# EAGLE design MRCS-cpNode (EAGLE 7.7.0)
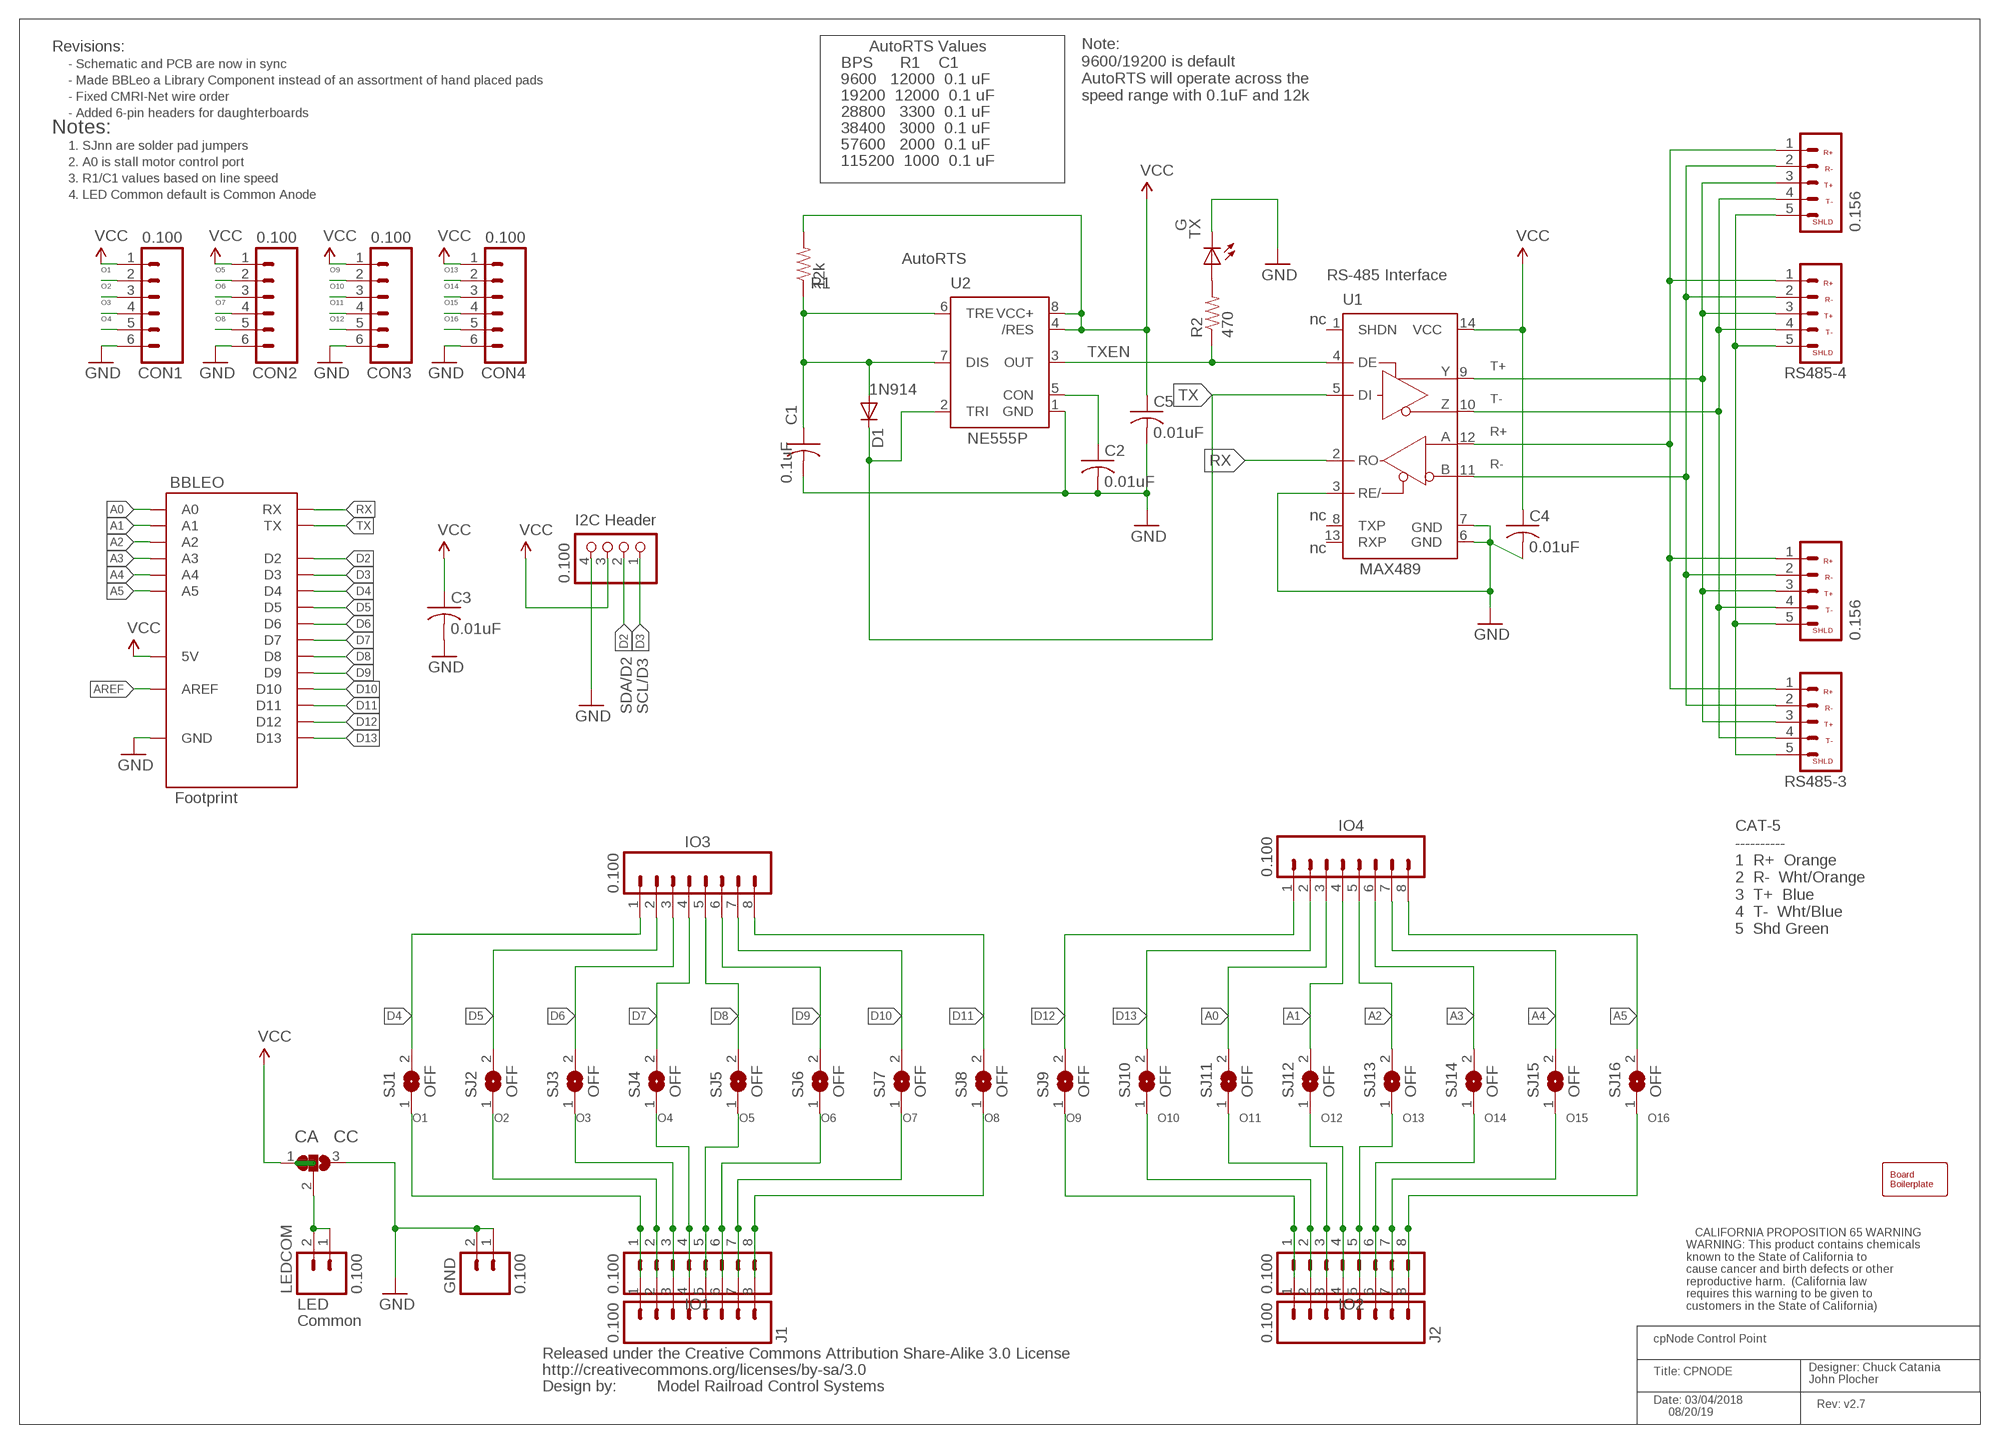
[diagram p0: schematic, sheet 1]

## Parts
BBLEO  Footprint  ARDUINO-BBLEO  [ARDUINO-BBLEO]
BOARD1  BOARD  BOARD69X100MRCS  [BOARD-DINRAIL-2.71IN-MRCS]
C1  0.1uF  CAPPTH2  [C-PTH-0.100]
C2  0.01uF  CAPPTH2  [C-PTH-0.100]
C3  0.01uF  CAPPTH2  [C-PTH-0.100]
C4  0.01uF  CAPPTH2  [C-PTH-0.100]
C5  0.01uF  CAPPTH2  [C-PTH-0.100]
CON1  0.100  CONNECTOR-M06SIP_LOCK  [1X06-SIP_LOCK]
CON2  0.100  CONNECTOR-M06SIP_LOCK  [1X06-SIP_LOCK]
CON3  0.100  CONNECTOR-M06SIP_LOCK  [1X06-SIP_LOCK]
CON4  0.100  CONNECTOR-M06SIP_LOCK  [1X06-SIP_LOCK]
D1  1N4148  DIODE1N4148  [DIODE-1N4148]
GND  0.100  M02POLAR_LOCK  [MOLEX-1X2_LOCK]
I2CHDR  0.100  PINHD-1X4/90  [1X04/90]
IO1  0.100  M081X08  [1X08]
IO2  0.100  M081X08  [1X08]
IO3  0.100  M081X08  [1X08]
IO4  0.100  M081X08  [1X08]
J1  0.100  CONNECTOR-M08LOCK_LONGPADS  [1X08_LOCK_LONGPADS]
J2  0.100  CONNECTOR-M08LOCK_LONGPADS  [1X08_LOCK_LONGPADS]
LEDCOM  0.100  M02POLAR_LOCK  [MOLEX-1X2_LOCK]
P1  CA CC  PAD-SOLDERJUMPER-2WAYT  [3P-SMD-2X4.8]
R1  12k  RPTH04  [AXIAL-0.4-RES]
R2  470  RPTH04  [AXIAL-0.4-RES]
RS485-1  0.156  CONNECTOR-CMRINET.156  [KK-156-5]
RS485-2  0.156  CONNECTOR-CMRINET.156  [KK-156-5]
RS485-3  3.5mm  CONNECTOR-CMRINET3.5MM  [CMRINET-3.5MM]
RS485-4  3.5mm  CONNECTOR-CMRINET3.5MM  [CMRINET-3.5MM]
SJ1  OFF  SJ  [SJ]
SJ2  OFF  SJ  [SJ]
SJ3  OFF  SJ  [SJ]
SJ4  OFF  SJ  [SJ]
SJ5  OFF  SJ  [SJ]
SJ6  OFF  SJ  [SJ]
SJ7  OFF  SJ  [SJ]
SJ8  OFF  SJ  [SJ]
SJ9  OFF  SJ  [SJ]
SJ10  OFF  SJ  [SJ]
SJ11  OFF  SJ  [SJ]
SJ12  OFF  SJ  [SJ]
SJ13  OFF  SJ  [SJ]
SJ14  OFF  SJ  [SJ]
SJ15  OFF  SJ  [SJ]
SJ16  OFF  SJ  [SJ]
TX  G  LEDLED3MM  [LED3MM]
U1  MAX3465CPD  [DIL14]
U2  NE555P  [DIL-08]
U$1  CREATIVE_COMMONS  [CREATIVE_COMMONS]
U$2  Prop65  CA-PROP65WARNING  [CA-PROP65WARNING]

## Nets
A0: BBLEO.A0 IO4.3 SJ11.2
A1: BBLEO.A1 IO4.4 SJ12.2
A2: BBLEO.A2 IO4.5 SJ13.2
A3: BBLEO.A3 IO4.6 SJ14.2
A4: BBLEO.A4 IO4.7 SJ15.2
A5: BBLEO.A5 IO4.8 SJ16.2
AREF: BBLEO.AR(AREF)
D2: BBLEO.SDA(D2) I2CHDR.2
D3: BBLEO.SCL(D3) I2CHDR.1
D4: BBLEO.D4 IO3.1 SJ1.2
D5: BBLEO.D5 IO3.2 SJ2.2
D6: BBLEO.D6 IO3.3 SJ3.2
D7: BBLEO.D7 IO3.4 SJ4.2
D8: BBLEO.D8 IO3.5 SJ5.2
D9: BBLEO.D9 IO3.6 SJ6.2
D10: BBLEO.D10 IO3.7 SJ7.2
D11: BBLEO.D11 IO3.8 SJ8.2
D12: BBLEO.D12 IO4.1 SJ9.2
D13: BBLEO.D13 IO4.2 SJ10.2
GND: BBLEO.GND@0(GND) BBLEO.GND@1(GND) BBLEO.GND@2(GND) BBLEO.GND@3(GND) BBLEO.GND@4(GND) C1.2 C2.2 C3.2 C4.2 C5.2 CON1.6 CON2.6 CON3.6 CON4.6 GND.1 GND.2 I2CHDR.4 P1.3 TX.K(C) U1.3(RE/) U1.6(GND) U1.7(GND) U2.1(GND)
N$29: R2.P$2 TX.A
N$38: C2.1 U2.5(CON)
N$45: LEDCOM.1 LEDCOM.2 P1.2
N$52: C1.1 D1.A R1.P$1 U2.6(TRE) U2.7(DIS)
N$54: R2.P$1 U1.4(DE) U2.3(OUT)
O1: CON1.2 IO1.1 J1.1 SJ1.1
O2: CON1.3 IO1.2 J1.2 SJ2.1
O3: CON1.4 IO1.3 J1.3 SJ3.1
O4: CON1.5 IO1.4 J1.4 SJ4.1
O5: CON2.2 IO1.5 J1.5 SJ5.1
O6: CON2.3 IO1.6 J1.6 SJ6.1
O7: CON2.4 IO1.7 J1.7 SJ7.1
O8: CON2.5 IO1.8 J1.8 SJ8.1
O9: CON3.2 IO2.1 J2.1 SJ9.1
O10: CON3.3 IO2.2 J2.2 SJ10.1
O11: CON3.4 IO2.3 J2.3 SJ11.1
O12: CON3.5 IO2.4 J2.4 SJ12.1
O13: CON4.2 IO2.5 J2.5 SJ13.1
O14: CON4.3 IO2.6 J2.6 SJ14.1
O15: CON4.4 IO2.7 J2.7 SJ15.1
O16: CON4.5 IO2.8 J2.8 SJ16.1
R+: RS485-1.1 RS485-2.1 RS485-3.1 RS485-4.1 U1.12(A)
R-: RS485-1.2 RS485-2.2 RS485-3.2 RS485-4.2 U1.11(B)
RX: BBLEO.RX U1.2(RO)
SHIELD: RS485-1.5 RS485-2.5 RS485-3.5 RS485-4.5
T+: RS485-1.3 RS485-2.3 RS485-3.3 RS485-4.3 U1.9(Y)
T-: RS485-1.4 RS485-2.4 RS485-3.4 RS485-4.4 U1.10(Z)
TX: BBLEO.TX D1.C U1.5(DI) U2.2(TRI)
VCC: BBLEO.+5V@1(5V) BBLEO.+5V@2(5V) BBLEO.+5V@3(5V) BBLEO.+5V@4(5V) C3.1 C4.1 C5.1 CON1.1 CON2.1 CON3.1 CON4.1 I2CHDR.3 P1.1 R1.P$2 U1.14(VCC) U2.4(/RES) U2.8(VCC+)
Unconnected: U1.1(SHDN) U1.8(TXP) U1.13(RXP)

## Notes on the sheet
- Revisions: | AutoRTS Values
- - Schematic and PCB are now in sync | BPS      R1    C1
- - Made BBLeo a Library Component instead of an assortment of hand placed pads | 9600   12000  0.1 uF
- - Fixed CMRI-Net wire order | 19200  12000  0.1 uF
- Note: 
  9600/19200 is default
  AutoRTS will operate across the
  speed range with 0.1uF and 12k
- - Added 6-pin headers for daughterboards | 28800   3300  0.1 uF
- Notes: | 38400   3000  0.1 uF
- 1. SJnn are solder pad jumpers | 57600   2000  0.1 uF
- 2. A0 is stall motor control port | 115200  1000  0.1 uF
- 3. R1/C1 values based on line speed
- 4. LED Common default is Common Anode
- AutoRTS
- RS-485 Interface
- nc
- TXEN
- T+
- 1N914
- T-
- R+
- R-
- nc
- I2C Header
- nc
- MAX489
- SDA/D2 | SCL/D3
- CAT-5
  ----------
  1  R+  Orange
  2  R-  Wht/Orange
  3  T+  Blue
  4  T-  Wht/Blue
  5  Shd Green
- LED
- Common
- cpNode Control Point
- Title: CPNODE
- Designer: Chuck Catania
  John Plocher
- Model Railroad Control Systems
- Rev: v2.7
- Date: 03/04/2018
       08/20/19

## Library data of the parts
BBLEO = SPCoast:ARDUINO-BBLEO
BOARD1 = SPCoast:BOARD
C1-C5 = SPCoast:CAP*
CON1-CON4 = SPCoast:CONNECTOR-M06: Header 6 Standard 6-pin 0.1" header
D1 = SPCoast:DIODE: Diode These are standard reverse protection diodes and small signal diodes. SMA package can handle up to about 1A. SOD-323 can handle about 200mA. What the SOD-323 package when ordering, there are some mfgs out there that are 5-pin packages.
GND LEDCOM = SparkFun:M02: Header 2 Standard 2-pin 0.1" header. Use with straight break away headers (SKU : PRT-00116), right angle break away headers (PRT-00553), swiss pins (PRT-00743), machine pins (PRT-00117), and female headers (PRT-00115). Molex polarized connector foot print use with SKU : PRT-08233 with associated crimp pins and housings.
I2CHDR = pinhead:PINHD-1X4: PIN HEADER
IO1-IO4 = SparkFun:M08: Header 8 Standard 8-pin 0.1" header. Use with straight break away headers (SKU : PRT-00116), right angle break away headers (PRT-00553), swiss pins (PRT-00743), machine pins (PRT-00117), and female headers (PRT-00115).
J1 J2 = SPCoast:CONNECTOR-M08: Header 8 Standard 8-pin 0.1" header. Use with straight break away headers (SKU : PRT-00116), right angle break away headers (PRT-00553), swiss pins (PRT-00743), machine pins (PRT-00117), and female headers (PRT-00115).
P1 = Discreter:PAD-SOLDERJUMPER-2WAY: Solder Jumper 2 way solder jumper
R1 R2 = SPCoast:R*: Resistor Basic schematic elements and footprints for 0603, 1206, and PTH 1/10th watt (small) resistors.
RS485-1-RS485-4 = SPCoast:CONNECTOR-CMRINET: CMRINet Top 3.5mm Screw Terminal 5 pos
SJ1-SJ16 = jumper:SJ: SMD solder JUMPER
TX = SPCoast:LED*
U1 = maxim:MAX346*: +5V, Fail-Safe, 40Mbps, Profibus RS-485/RS-422 Transceivers Source: MAX3465-MAX3469.pdf; MPN: MAX3465CPD+; OC_FARNELL: unknown; OC_NEWARK: 42M5444
U2 = SparkFun:NE555: General purpose bipolar Timer; MF: Arrow Electronics; MPN: NE555N; OC_FARNELL: 1467742; OC_NEWARK: 89K1486
U$1 = SparkFun:CREATIVE_COMMONS
U$2 = MRCS-prop65warningTop:CA-PROP65WARNING: CALIFORNIA PROPOSITION 65 WARNING

## Board
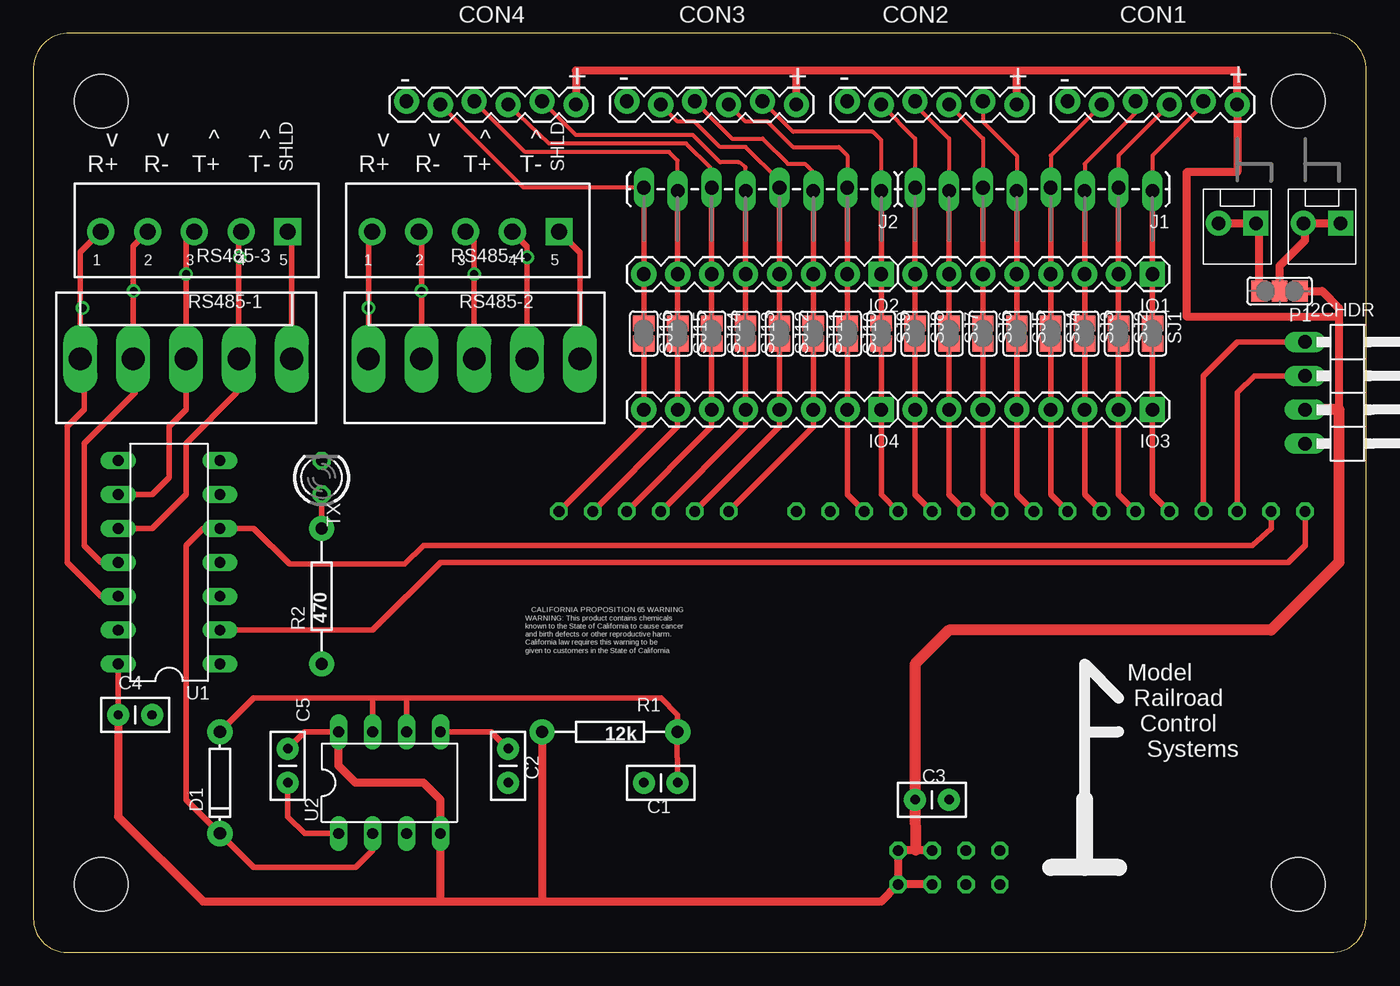
[diagram p1: board, top side]
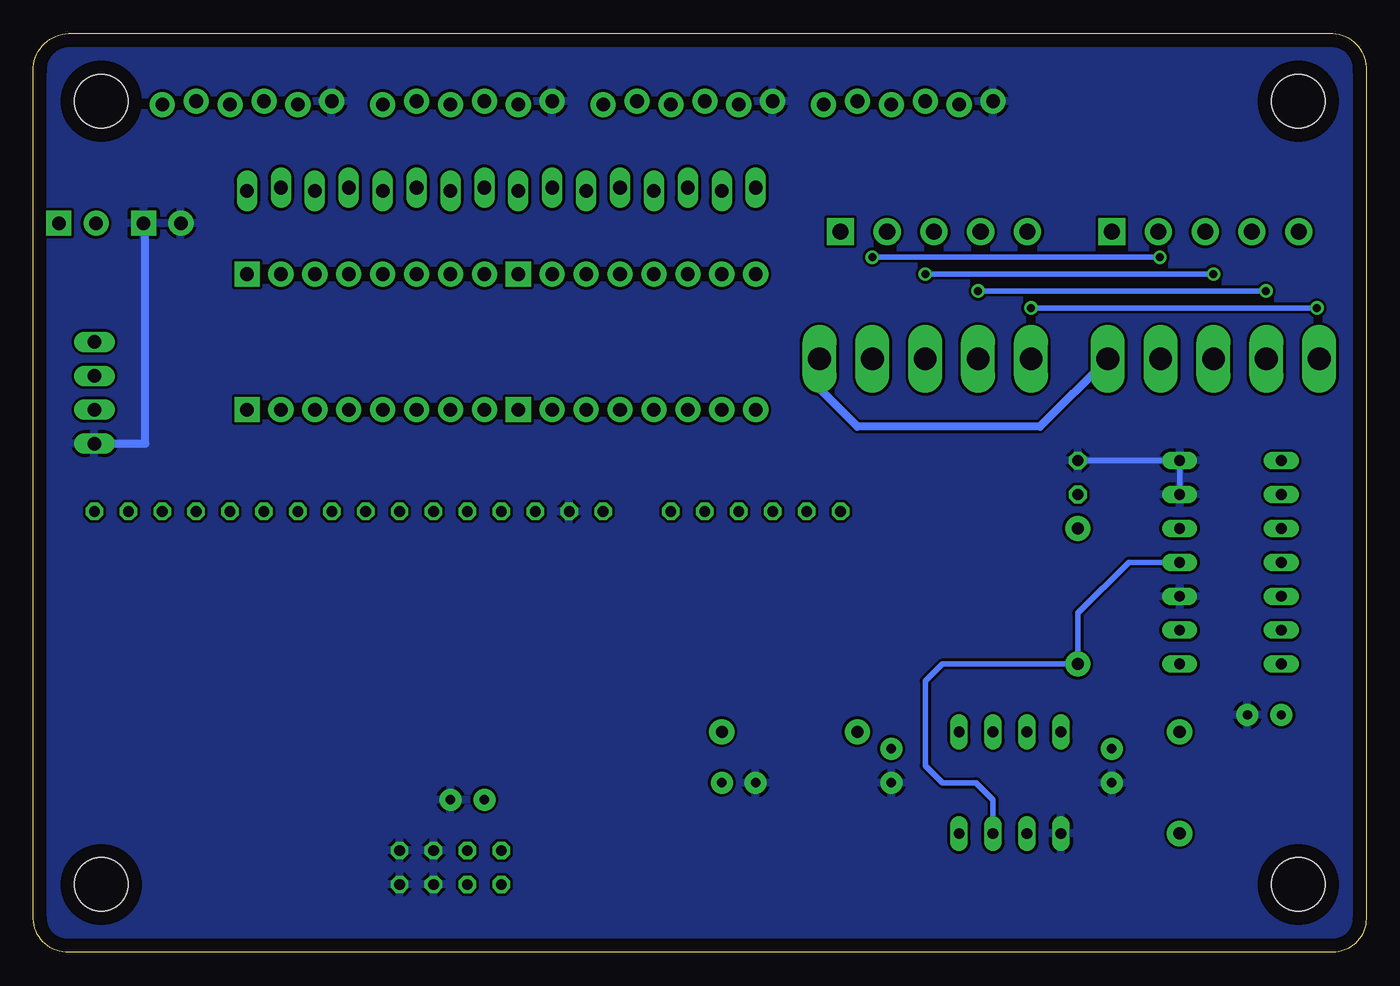
[diagram p2: board, bottom side, seen from below]

Size 99.82 x 68.83 mm. Coordinates in mm from the lower left corner, seen from the top.
Copper layers (1*16): Top 0.035mm / dielectric 1.5mm / Bottom 0.035mm
Design rules "default": minimum track width 10mil, minimum drill 0.6mm, track to track 8mil, track to pad 8mil, pad to pad 8mil, via to via 8mil, smd to smd 8mil, copper to edge 40mil, drill to drill 8mil, minimum pad ring 10mil, minimum via ring 8mil, stop-mask expansion 4mil, vias tented up to drill 0mil, thermal gap 10mil

### Footprints (pad centres in the part's own frame; a part is rotated, then mirrored left to right if it is on the bottom)
ARDUINO-BBLEO = drill 0.8 octagon: +5V@1 40.64,5.08; +5V@2 40.64,2.54; +5V@3 38.1,5.08; +5V@4 38.1,2.54; A0 25.4,30.48; A1 22.86,30.48; A2 20.32,30.48; A3 17.78,30.48; A4 15.24,30.48; A5 12.7,30.48; AR 30.48,30.48; D4 58.42,30.48; D5 55.88,30.48; D6 53.34,30.48; D7 50.8,30.48; D8 48.26,30.48; D9 45.72,30.48; D10 43.18,30.48; D11 40.64,30.48; D12 38.1,30.48; D13 35.56,30.48; GND@0 33.02,30.48; GND@1 43.18,5.08; GND@2 45.72,5.08; GND@3 43.18,2.54; GND@4 45.72,2.54; RX 68.58,30.48; SCL 60.96,30.48; SDA 63.5,30.48; TX 66.04,30.48
BOARD-DINRAIL-2.71IN-MRCS = hole 4: 94.742,5.08; 5.08,63.754; 94.742,63.754; 5.08,5.08
C-PTH-0.100 = drill 0.7 pad 1.651: 1 -1.27,0; 2 1.27,0
1X06-SIP_LOCK = drill 1.016 pad 1.88: 1 0,0; 2 2.54,-0.254; 3 5.08,0; 4 7.62,-0.254; 5 10.16,0; 6 12.7,-0.254
DIODE-1N4148 = drill 0.9 pad 1.88: A 3.81,0; C -3.81,0
MOLEX-1X2_LOCK = drill 1.016 pad 1.88 square: 1 -0.127,0 | drill 1.016 pad 1.88: 2 2.667,0
1X04/90 = drill 1.016 long: 1 -3.81,-3.81; 2 -1.27,-3.81; 3 1.27,-3.81; 4 3.81,-3.81
1X08 = drill 1.016 pad 1.88 square: 1 0,0 | drill 1.016 pad 1.88: 2 2.54,0; 3 5.08,0; 4 7.62,0; 5 10.16,0; 6 12.7,0; 7 15.24,0; 8 17.78,0
1X08_LOCK_LONGPADS = drill 1.016 long: 1 0,0.127; 2 2.54,-0.127; 3 5.08,0.127; 4 7.62,-0.127; 5 10.16,0.127; 6 12.7,-0.127; 7 15.24,0.127; 8 17.78,-0.127
3P-SMD-2X4.8 = smd 1.168 x 1.6: 1 -1.524,0; 2 0,0; 3 1.524,0
AXIAL-0.4-RES = drill 0.9 pad 1.88: P$1 -5.08,0; P$2 5.08,0
KK-156-5 = drill 1.7 pad 2.184 long: 1 -7.92,0; 2 -3.96,0; 3 0,0; 4 3.96,0; 5 7.92,0
CMRINET-3.5MM = drill 1.2 pad 2.032: 1 -6.38,0; 2 -2.88,0; 3 0.62,0; 4 4.12,0 | drill 1.2 pad 2.032 square: 5 7.62,0
SJ = smd 1.168 x 1.6: 1 -0.762,0; 2 0.762,0
LED3MM = drill 0.813 octagon: A 1.27,0; K -1.27,0
DIL14 = drill 0.813 long: 1 -7.62,-3.81; 2 -5.08,-3.81; 3 -2.54,-3.81; 4 0,-3.81; 5 2.54,-3.81; 6 5.08,-3.81; 7 7.62,-3.81; 8 7.62,3.81; 9 5.08,3.81; 10 2.54,3.81; 11 0,3.81; 12 -2.54,3.81; 13 -5.08,3.81; 14 -7.62,3.81
DIL-08 = drill 0.813 long: 1 -3.81,-3.81; 2 -1.27,-3.81; 3 1.27,-3.81; 4 3.81,-3.81; 5 3.81,3.81; 6 1.27,3.81; 7 -1.27,3.81; 8 -3.81,3.81

### Placement (x,y rotation side)
BBLEO  26.67,2.54 0 top
BOARD1  0,0 0 top
C1  46.99,12.7 180 top
C2  35.56,13.97 270 top
C3  67.31,11.43 0 top
C4  7.62,17.78 0 top
C5  19.05,13.97 270 top
CON1  90.17,63.5 180 top
CON2  73.66,63.5 180 top
CON3  57.15,63.5 180 top
CON4  40.64,63.5 180 top
D1  13.97,12.7 90 top
GND  91.44,54.61 180 top
I2CHDR  99.06,41.91 270 top
IO1  83.82,50.8 180 top
IO2  63.5,50.8 180 top
IO3  83.82,40.64 180 top
IO4  63.5,40.64 180 top
J1  83.82,57.15 180 top
J2  63.5,57.15 180 top
LEDCOM  97.79,54.61 180 top
P1  93.35,49.53 180 top
R1  43.18,16.51 180 top
R2  21.59,26.67 90 top
RS485-1  11.43,44.45 0 top
RS485-2  33.02,44.45 0 top
RS485-3  11.43,53.98 0 top
RS485-4  31.75,53.98 0 top
SJ1  83.82,46.35 270 top
SJ2  81.28,46.35 270 top
SJ3  78.74,46.35 270 top
SJ4  76.2,46.35 270 top
SJ5  73.66,46.35 270 top
SJ6  71.12,46.35 270 top
SJ7  68.58,46.35 270 top
SJ8  66.04,46.35 270 top
SJ9  63.5,46.35 270 top
SJ10  60.96,46.35 270 top
SJ11  58.42,46.35 270 top
SJ12  55.88,46.35 270 top
SJ13  53.34,46.35 270 top
SJ14  50.8,46.35 270 top
SJ15  48.26,46.35 270 top
SJ16  45.72,46.35 270 top
TX  21.59,35.56 270 top
U1  10.16,29.21 90 top
U2  26.67,12.7 0 top
U$1  17.78,-11.43 0 top  (outside the outline)
U$2  43.18,24.13 0 top
U$3  MRCS  [MRCS-LOGO]  78.74,6.35 0 top

### Tracks (layer width: path | path; a pad name or v marks a point on that pad's centre or on a via)
A0
  Top 0.406: SJ11.2 IO4.3 58.42,39.37 BBLEO.A0
A1
  Top 0.406: SJ12.2 IO4.4 55.88,39.37 BBLEO.A1
A2
  Top 0.406: SJ13.2 IO4.5 53.34,39.37 BBLEO.A2
A3
  Top 0.406: SJ14.2 IO4.6 50.8,39.37 BBLEO.A3
A4
  Top 0.406: SJ15.2 IO4.7 48.26,39.37 BBLEO.A4
A5
  Top 0.406: SJ16.2 IO4.8 45.72,39.37 BBLEO.A5
D2
  Top 0.406: I2CHDR.2 91.44,43.18 90.17,41.91 BBLEO.SDA
D3
  Top 0.406: I2CHDR.1 90.17,45.72 87.63,43.18 BBLEO.SCL
D4
  Top 0.406: SJ1.2 IO3.1 83.82,34.29 BBLEO.D4
D5
  Top 0.406: SJ2.2 IO3.2 81.28,34.29 BBLEO.D5
D6
  Top 0.406: SJ3.2 IO3.3 78.74,34.29 BBLEO.D6
D7
  Top 0.406: SJ4.2 IO3.4 76.2,34.29 BBLEO.D7
D8
  Top 0.406: SJ5.2 IO3.5 73.66,34.29 BBLEO.D8
D9
  Top 0.406: SJ6.2 IO3.6 71.12,34.29 BBLEO.D9
D10
  Top 0.406: SJ7.2 IO3.7 68.58,34.29 BBLEO.D10
D11
  Top 0.406: SJ8.2 IO3.8 66.04,34.29 BBLEO.D11
D12
  Top 0.406: SJ9.2 IO4.1 63.5,34.29 BBLEO.D12
D13
  Top 0.406: SJ10.2 IO4.2 60.96,34.29 BBLEO.D13
GND
  Top 0.406: 91.82,54.23 GND.1 | C5.2 19.05,10.16 20.32,8.89 U2.1
  Top 0.61: GND.2 GND.1 | P1.3 91.82,54.23
  Bottom 0.406: TX.K U1.7 U1.6
  Bottom 0.61: I2CHDR.4 91.44,38.1 91.44,54.61 GND.1
  pour Bottom: 0,68.58 99.7,68.58 99.7,6.99 99.7,0 0,0
N$29
  Top 0.406: TX.A R2.P$2
N$38
  Top 0.406: U2.5 34.29,16.51 C2.1
N$45
  Top 0.406: 95.25,54.48 LEDCOM.2
  Top 0.61: 94.62,49.53 P1.2 93.35,51.44 95.25,53.34 95.25,54.48 | LEDCOM.2 LEDCOM.1
N$52
  Top 0.406: C1.1 48.22,16.47 R1.P$1 48.26,17.78 46.99,19.05 27.94,19.05 | D1.A 16.51,19.05 25.4,19.05 | 25.4,19.05 27.94,19.05 | 27.94,19.05 U2.6 | U2.7 25.4,19.05
N$54
  Bottom 0.406: U1.4 17.78,29.21 21.59,25.4 R2.P$1 31.75,21.59 33.02,20.32 33.02,13.97 31.75,12.7 29.21,12.7 27.94,11.43 U2.3
O1
  Top 0.305: CON1.2 87.63,63.5 83.82,59.69 J1.1
  Top 0.406: SJ1.1 IO1.1 J1.1
O2
  Top 0.305: CON1.3 81.28,59.69 J1.2
  Top 0.406: SJ2.1 IO1.2 J1.2
O3
  Top 0.305: CON1.4 82.55,62.87 78.74,59.05 J1.3
  Top 0.406: SJ3.1 IO1.3 J1.3
O4
  Top 0.305: CON1.5 76.2,59.69 J1.4
  Top 0.406: SJ4.1 IO1.4 J1.4
O5
  Top 0.305: CON2.2 71.12,62.23 73.66,59.69 J1.5
  Top 0.406: SJ5.1 IO1.5 J1.5
O6
  Top 0.305: CON2.3 71.12,60.96 J1.6
  Top 0.406: SJ6.1 IO1.6 J1.6
O7
  Top 0.305: CON2.4 66.04,63.5 68.58,60.96 J1.7
  Top 0.406: SJ7.1 IO1.7 J1.7
O8
  Top 0.305: CON2.5 66.04,60.96 J1.8
  Top 0.406: SJ8.1 IO1.8 J1.8
O9
  Top 0.305: J2.1 63.5,60.83 62.87,61.47 56.9,61.47 CON3.2
  Top 0.406: SJ9.1 IO2.1 J2.1
O10
  Top 0.305: CON3.3 53.34,62.23 54.99,62.23 56.9,60.33 60.33,60.33 60.96,59.69 J2.2
  Top 0.406: SJ10.1 IO2.2 J2.2
O11
  Top 0.305: CON3.4 52.33,60.96 54.61,60.96 56.52,59.05 57.79,59.05 58.42,58.42 J2.3
  Top 0.406: SJ11.1 IO2.3 J2.3
O12
  Top 0.305: CON3.5 48.26,62.23 49.53,62.23 51.44,60.33 53.34,60.33 55.88,57.78 J2.4
  Top 0.406: SJ12.1 IO2.4 J2.4
O13
  Top 0.305: J2.5 53.34,58.8 52.83,59.18 51.44,59.18 49.41,61.21 40.64,61.21 CON4.2
  Top 0.406: SJ13.1 IO2.5 J2.5
O14
  Top 0.305: J2.6 50.8,58.17 50.68,58.8 48.9,60.58 38.61,60.58 36.32,62.74 CON4.3
  Top 0.406: SJ14.1 IO2.6 J2.6
O15
  Top 0.305: J2.7 48.26,59.31 47.63,59.94 36.83,59.94 CON4.4
  Top 0.406: SJ15.1 IO2.7 J2.7
O16
  Top 0.305: J2.8 36.71,57.28 CON4.5
  Top 0.406: SJ16.1 IO2.8 J2.8
R+  (via drill 0.6)
  Top 0.406: 3.51,48.09 3.51,52.44 RS485-3.1 | 3.51,48.09 RS485-1.1 3.81,44.15 3.81,40.64 2.54,39.37 2.54,29.21 5.08,26.67 U1.12 | RS485-4.1 25.1,53.7 v25.1,48.26 RS485-2.1 | 3.51,48.09 v3.68,48.26
  Bottom 0.406: v3.68,48.26 v25.1,48.26
R-  (via drill 0.6)
  Top 0.406: 7.47,49.56 7.47,52.9 RS485-3.2 | 7.47,49.56 RS485-1.2 7.62,44.3 7.62,41.91 3.81,38.1 3.81,30.48 5.08,29.21 U1.11 | RS485-4.2 29.06,53.78 v29.06,49.53 RS485-2.2 | 7.47,49.56 v7.5,49.53
  Bottom 0.406: v7.5,49.53 v29.06,49.53
RX
  Top 0.406: BBLEO.RX 95.25,30.48 93.98,29.21 30.48,29.21 25.4,24.13 U1.2
SHIELD
  Top 0.406: RS485-1.5 19.35,53.67 RS485-3.5 | RS485-4.5 40.94,52.41 RS485-2.5
  Bottom 0.61: RS485-1.5 24.43,39.37 38.1,39.37 40.94,42.21 RS485-2.5
T+  (via drill 0.6)
  Top 0.406: RS485-4.3 33.02,53.33 v33.02,50.8 RS485-2.3 | RS485-3.3 11.43,53.35 v11.43,50.8 RS485-1.3 11.43,40.64 10.16,39.37 10.16,35.56 8.89,34.29 U1.9
  Bottom 0.406: v11.43,50.8 v33.02,50.8
T-  (via drill 0.6)
  Top 0.406: 15.39,52.13 15.39,53.81 RS485-3.4 | 15.39,52.13 RS485-1.4 15.24,44.3 15.24,41.91 11.43,38.1 11.43,34.29 8.89,31.75 U1.10 | RS485-4.4 36.98,52.87 v36.98,52.07 RS485-2.4 | 15.39,52.13 v15.45,52.07
  Bottom 0.406: v15.45,52.07 v36.98,52.07
TX
  Top 0.406: BBLEO.TX 92.71,31.75 91.32,30.48 29.21,30.48 27.82,29.08 19.18,29.08 16.51,31.75 U1.5 12.7,31.75 11.43,30.48 11.43,11.43 D1.C 16.51,6.35 24.13,6.35 25.4,7.62 U2.2
VCC
  Top 0.406: U1.14 C4.1 | C5.1 20.32,16.51 U2.8
  Top 0.61: P1.1 96.52,49.53 97.79,48.26 97.79,47.62 | 97.79,47.62 97.79,40.64 | BBLEO.+5V@1 66.04,7.62 | 66.04,7.62 BBLEO.+5V@3 BBLEO.+5V@4 | BBLEO.+5V@2 BBLEO.+5V@4 | 66.08,7.66 66.04,7.62 | C4.1 6.35,10.16 12.7,3.81 30.48,3.81 | 30.48,3.81 38.1,3.81 | 38.1,3.81 63.5,3.81 BBLEO.+5V@4 | 30.48,3.81 U2.4 30.48,11.43 29.21,12.7 24.13,12.7 22.86,13.97 U2.8 | R1.P$2 38.1,3.81 | 66.04,11.47 C3.1 | 73.66,66.04 90.17,66.04 CON1.1 90.17,58.42 86.36,58.42 86.36,47.62 97.79,47.62 | 73.66,66.04 57.15,66.04 | 57.15,66.04 40.64,66.04 CON4.1 | CON2.1 73.66,66.04 | CON3.1 57.15,66.04
  Top 0.813: I2CHDR.3 97.79,40.64 97.79,29.21 92.71,24.13 68.58,24.13 66.04,21.59 66.04,11.47 | C3.1 66.08,7.66

### Text on the board
tPlace: - | + | - | + | - | + | - | +
tDocu: A5 | A4 | A3 | A2 | A1 | A0 | D13 | D12 | D11 | D10 | D9 | D8 | D7 | D6 | D5 | D4 | LED | Com | GND | MRCS Design | cpNode | Control Point Node | v2.7 | 2021-06